# EAGLE design biochem_M (EAGLE 9.6.2)
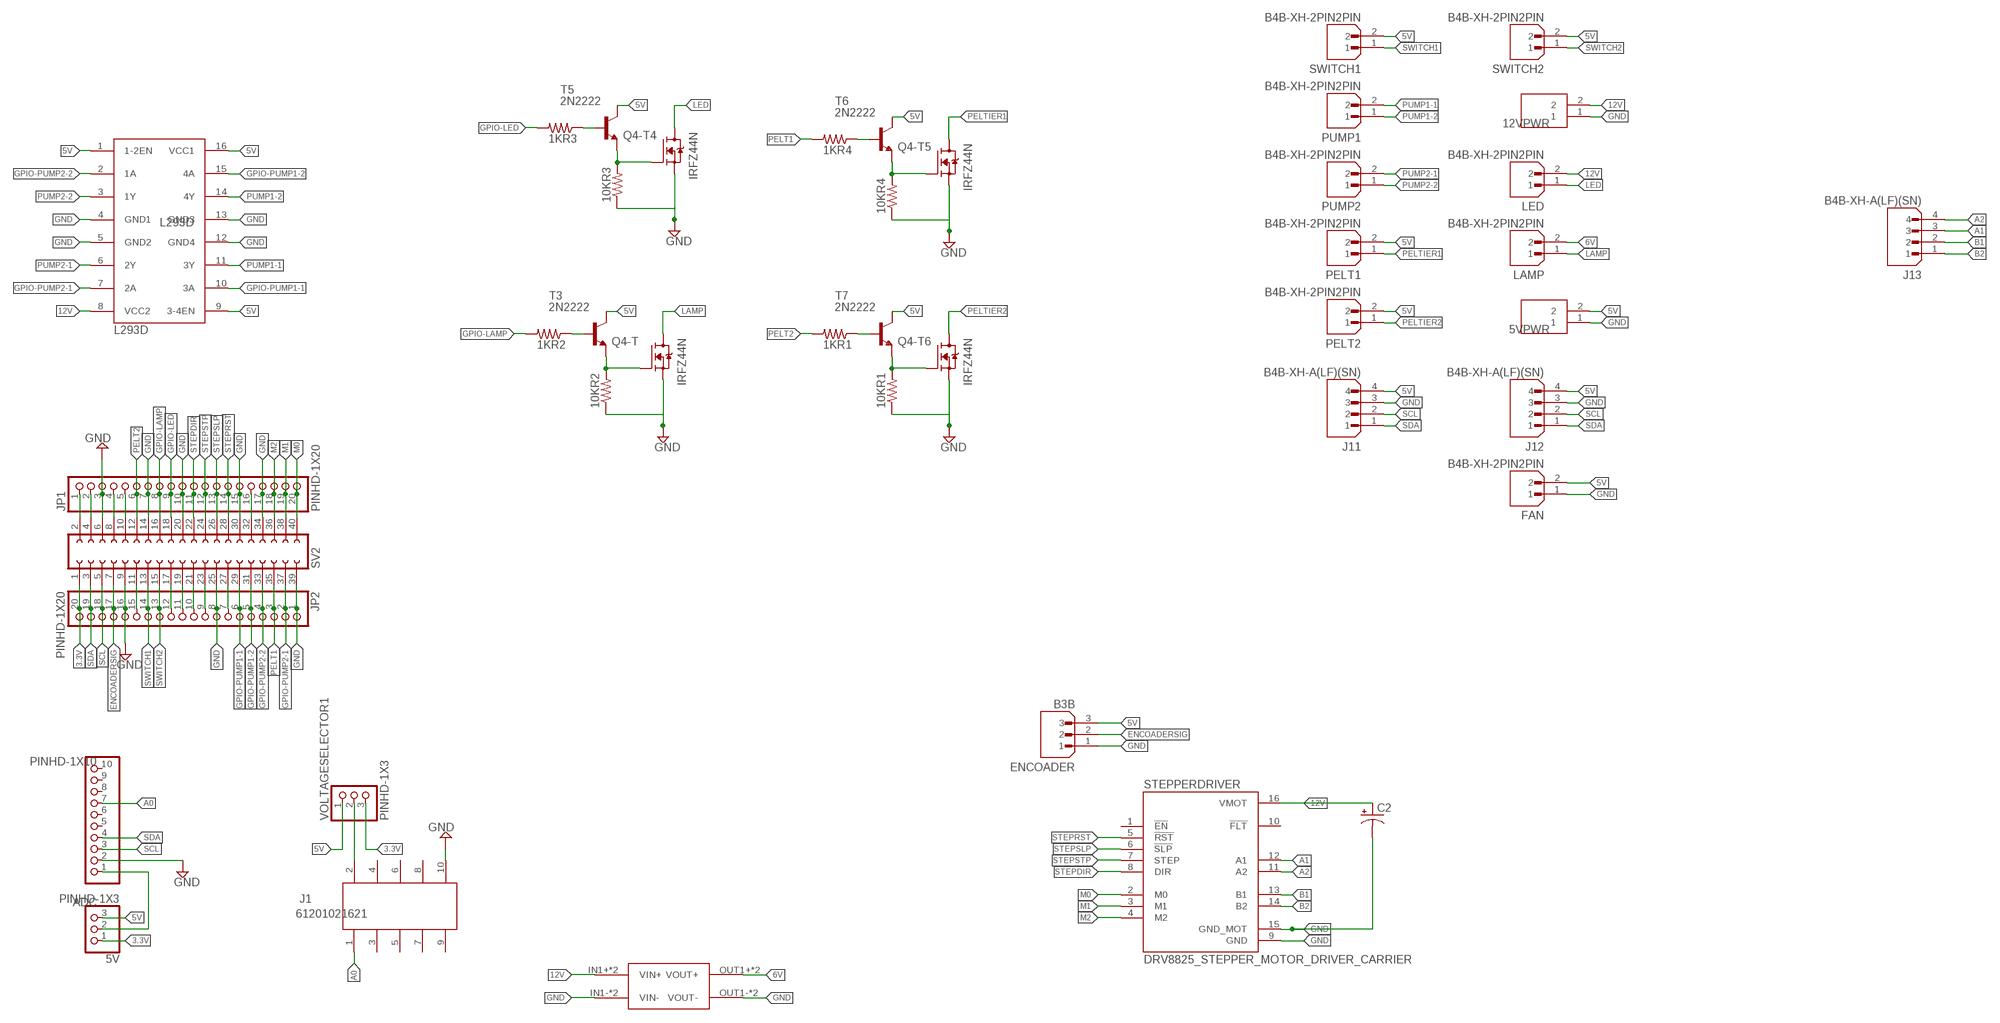
[diagram p0: schematic, sheet 1]

## Parts
1KR1  R-US_0204/7  [0204/7]
1KR2  R-US_0204/7  [0204/7]
1KR3  R-US_0204/7  [0204/7]
1KR4  R-US_0204/7  [0204/7]
5V  PINHD-1X3  [1X03]
5VPWR  TB010-508-02BE  [CUI_TB010-508-02BE]
10KR1  R-US_0204/7  [0204/7]
10KR2  R-US_0204/7  [0204/7]
10KR3  R-US_0204/7  [0204/7]
10KR4  R-US_0204/7  [0204/7]
12VPWR  TB010-508-02BE  [CUI_TB010-508-02BE]
ADC  PINHD-1X10  [1X10]
C2  CPOL-USB45181A  [B45181A]
ENCOADER  B3B  [B3B]
FAN  B4B-XH-2PIN2PIN  [B4BXH2]
J1  61201021621  [61201021621]
J11  B4B-XH-A(LF)(SN)  [JST_B4B-XH-A(LF)(SN)]
J12  B4B-XH-A(LF)(SN)  [JST_B4B-XH-A(LF)(SN)]
J13  B4B-XH-A(LF)(SN)  [JST_B4B-XH-A(LF)(SN)]
JP1  PINHD-1X20  [1X20]
JP2  PINHD-1X20  [1X20]
L293D  L293D  [DIL16]
LAMP  B4B-XH-2PIN2PIN  [B4BXH2]
LED  B4B-XH-2PIN2PIN  [B4BXH2]
PELT1  B4B-XH-2PIN2PIN  [B4BXH2]
PELT2  B4B-XH-2PIN2PIN  [B4BXH2]
PUMP1  B4B-XH-2PIN2PIN  [B4BXH2]
PUMP2  B4B-XH-2PIN2PIN  [B4BXH2]
Q4-T  IRFZ44N  [TO254P1016X419X2286-3]
Q4-T4  IRFZ44N  [TO254P1016X419X2286-3]
Q4-T5  IRFZ44N  [TO254P1016X419X2286-3]
Q4-T6  IRFZ44N  [TO254P1016X419X2286-3]
STEPPERDRIVER  DRV8825_STEPPER_MOTOR_DRIVER_CARRIER  [IC_DRV8825_STEPPER_MOTOR_DRIVER_CARRIER]
SV2  FE20-2  [FE20-2]
SWITCH1  B4B-XH-2PIN2PIN  [B4BXH2]
SWITCH2  B4B-XH-2PIN2PIN  [B4BXH2]
T3  2N2222  [TO92-EBC-OVAL]
T5  2N2222  [TO92-EBC-OVAL]
T6  2N2222  [TO92-EBC-OVAL]
T7  2N2222  [TO92-EBC-OVAL]
U$1  MP1584  [DC-BRICK]
VOLTAGESELECTOR1  PINHD-1X3  [1X03]

## Nets
3.3V: 5V.1 JP2.20 SV2.1 VOLTAGESELECTOR1.3
5V: 5V.3 5VPWR.2 ENCOADER.3 FAN.2 J11.4 J12.4 L293D.1(1-2EN) L293D.9(3-4EN) L293D.16(VCC1) PELT1.2 PELT2.2 SWITCH1.2 SWITCH2.2 T3.C T5.C T6.C T7.C VOLTAGESELECTOR1.1
6V: LAMP.2 U$1.OUT1+(VOUT+) U$1.OUT2+(VOUT+)
12V: 12VPWR.2 C2.+ L293D.8(VCC2) LED.2 STEPPERDRIVER.16(VMOT) U$1.IN1+(VIN+) U$1.IN2+(VIN+)
A0: ADC.7 J1.1
A1: J13.3 STEPPERDRIVER.12(A1)
A2: J13.4 STEPPERDRIVER.11(A2)
B1: J13.2 STEPPERDRIVER.13(B1)
B2: J13.1 STEPPERDRIVER.14(B2)
ENCOADERSIG: ENCOADER.2 JP2.17 SV2.7
GND: 5VPWR.1 10KR1.1 10KR2.1 10KR3.1 10KR4.1 12VPWR.1 ADC.2 C2.- ENCOADER.1 FAN.1 J1.10 J11.3 J12.3 JP1.3 JP1.7 JP1.10 JP1.15 JP1.17 JP2.1 JP2.8 JP2.16 L293D.4(GND1) L293D.5(GND2) L293D.12(GND4) L293D.13(GND3) Q4-T4.3(S) Q4-T5.3(S) Q4-T6.3(S) Q4-T.3(S) STEPPERDRIVER.9(GND) STEPPERDRIVER.15(GND_MOT) SV2.6 SV2.9 SV2.14 SV2.20 SV2.25 SV2.30 SV2.34 SV2.39 U$1.IN1-(VIN-) U$1.IN2-(VIN-) U$1.OUT1-(VOUT-) U$1.OUT2-(VOUT-)
GPIO-LAMP: 1KR2.2 JP1.8 SV2.16
GPIO-LED: 1KR3.2 JP1.9 SV2.18
GPIO-PUMP1-1: JP2.6 L293D.10(3A) SV2.29
GPIO-PUMP1-2: JP2.5 L293D.15(4A) SV2.31
GPIO-PUMP2-1: JP2.2 L293D.7(2A) SV2.37
GPIO-PUMP2-2: JP2.4 L293D.2(1A) SV2.33
LAMP: LAMP.1 Q4-T.2(D)
LED: LED.1 Q4-T4.2(D)
M0: JP1.20 STEPPERDRIVER.2(M0) SV2.40
M1: JP1.19 STEPPERDRIVER.3(M1) SV2.38
M2: JP1.18 STEPPERDRIVER.4(M2) SV2.36
N$1: JP1.1 SV2.2
N$2: JP1.2 SV2.4
N$3: JP1.4 SV2.8
N$4: 10KR2.2 Q4-T.1(G) T3.E
N$5: 1KR2.1 T3.B
N$6: JP1.5 SV2.10
N$7: JP2.15 SV2.11
N$8: J1.2 VOLTAGESELECTOR1.2
N$10: 5V.2 ADC.1
N$11: 10KR3.2 Q4-T4.1(G) T5.E
N$12: 1KR3.1 T5.B
N$14: 10KR4.2 Q4-T5.1(G) T6.E
N$15: 1KR4.1 T6.B
N$16: 10KR1.2 Q4-T6.1(G) T7.E
N$17: 1KR1.1 T7.B
N$20: JP1.16 SV2.32
N$26: JP2.7 SV2.27
N$28: JP2.9 SV2.23
N$29: JP2.10 SV2.21
N$30: JP2.11 SV2.19
N$31: JP2.12 SV2.17
PELT1: 1KR4.2 JP2.3 SV2.35
PELT2: 1KR1.2 JP1.6 SV2.12
PELTIER1: PELT1.1 Q4-T5.2(D)
PELTIER2: PELT2.1 Q4-T6.2(D)
PUMP1-1: L293D.11(3Y) PUMP1.2
PUMP1-2: L293D.14(4Y) PUMP1.1
PUMP2-1: L293D.6(2Y) PUMP2.2
PUMP2-2: L293D.3(1Y) PUMP2.1
SCL: ADC.3 J11.2 J12.2 JP2.18 SV2.5
SDA: ADC.4 J11.1 J12.1 JP2.19 SV2.3
STEPDIR: JP1.11 STEPPERDRIVER.8(DIR) SV2.22
STEPRST: JP1.14 STEPPERDRIVER.5(!RST) SV2.28
STEPSLP: JP1.13 STEPPERDRIVER.6(!SLP) SV2.26
STEPSTP: JP1.12 STEPPERDRIVER.7(STEP) SV2.24
SWITCH1: JP2.14 SV2.13 SWITCH1.1
SWITCH2: JP2.13 SV2.15 SWITCH2.1
Unconnected: ADC.5 ADC.6 ADC.8 ADC.9 ADC.10 J1.3 J1.4 J1.5 J1.6 J1.7 J1.8 J1.9 STEPPERDRIVER.1(!EN) STEPPERDRIVER.10(!FLT)

## Library data of the parts
1KR1-1KR4 10KR1-10KR4 = rcl:R-US_: RESISTOR, American symbol; SPICEPREFIX: R
5V VOLTAGESELECTOR1 = Connector:PINHD-1X3: PIN HEADER; CATEGORY: CONNECTOR; SUB-CATEGORY: PIN-HEADER
5VPWR 12VPWR = TB010-508-02BE:TB010-508-02BE: Check prices <https://pricing.snapeda.com/parts/TB010-508-02BE/CUI%20Devices/view-part?ref=eda>; AVAILABILITY: Good; CUI_PURCHASE_URL: https://www.cuidevices.com/product/interconnect/connectors/terminal-blocks/tb010-508-series?utm_source=snapeda.com&utm_medium=referral&utm_campaign=snapedaBOM; DESCRIPTION: 2~24 Poles, Screw Type, Horizontal, 5.08 Pitch, 26~12 (AWG), Terminal Block Connector; MF: CUI Devices; MP: TB010-508-02BE; PACKAGE: None; PRICE: None; PURCHASE-URL: https://pricing.snapeda.com/search/part/TB010-508-02BE/?ref=eda
ADC = Connector:PINHD-1X10: PIN HEADER; CATEGORY: CONNECTOR; SUB-CATEGORY: PIN-HEADER
C2 = adafruit:CPOL-US: POLARIZED CAPACITOR, American symbol
ENCOADER = B4B-XH-A_LF__SN_:B3B
FAN LAMP LED PELT1 PELT2 PUMP1 PUMP2 SWITCH1 SWITCH2 = B4B-XH-A_LF__SN_:B4B-XH-2PIN: Check availability <https://pricing.snapeda.com/parts/B4B-XH-A%20%20%28LF%29%28SN%29/JST/view-part?ref=eda>
J1 = 61201021621:61201021621: WR-BHD 2.54mm Male Box Header, 10 Pins=>Code : Con_WTB_BHD_2.54_Male_THT_WS_61201021621 <http://katalog.we-online.de/media/thumbs2/eican/thb_Con_WTB_BHD_2.54_Male_THT_WS_6120xx21621_pf2.jpg> Details see: http://katalog.we-online.de/en/em/612_0xx_216_21 Created 2014-06-04, Karrer Zheng 2014 (C) Würth Elektronik Check availability <https://pricing.snapeda.com/parts/61201021621/Wurth%20Elektronik/view-part?ref=eda>; AVAILABILITY: In Stock; DESCRIPTION: Connector Header Through Hole 10 position 0.100 (2.54mm); MF: Wurth Elektronik; MP: 61201021621; PACKAGE: None; PRICE: None; PURCHASE-URL: https://pricing.snapeda.com/search/part/61201021621/?ref=eda
J11-J13 = B4B-XH-A_LF__SN_:B4B-XH-A(LF)(SN): Check availability <https://pricing.snapeda.com/parts/B4B-XH-A%20%20%28LF%29%28SN%29/JST/view-part?ref=eda>; AVAILABILITY: In Stock; DESCRIPTION: HEADER, VERTICAL, 4WAY; Pitch Spacing: 2.5mm; No. of Contacts: 4Contacts; Gender: Header; Product Range: XH Series; Contact Termination Type: Through Hole; No. of Rows: 1Rows; Contact Plating: Tin Plated Contacts; Contact Material: Brass; SVHC: No SVHC (17-Dec-2015); Contact Resistance: 10mohm; Current Rating: 3A; Insulation Resistance: 1000Mohm; Operating Temperature Max: 85°C; Operating Temperature Min: -25°C; Voltage Rating VAC: 250V; Wire Size AWG Max: 22AWG; Wire Size AWG Min: 30AWG; Withstand Voltage: 1000V; MF: JST; MP: B4B-XH-A (LF)(SN); PACKAGE: None; PRICE: None; PURCHASE-URL: https://pricing.snapeda.com/search/part/B4B-XH-A (LF)(SN)/?ref=eda
JP1 JP2 = Connector:PINHD-1X20: PIN HEADER; CATEGORY: CONNECTOR; SUB-CATEGORY: PIN-HEADER
L293D = st-microelectronics:L293D: PUSH-PULL 4 CHANNEL DRIVER; MPN: L293D; OC_FARNELL: 9589619; OC_NEWARK: 56P8249
Q4-T Q4-T4-Q4-T6 = IRFZ44N:IRFZ44N: Check availability <https://pricing.snapeda.com/parts/IRFZ44N/Infineon%20Technologies/view-part?ref=eda>; AVAILABILITY: In Stock; DESCRIPTION: N-Channel 55 V 49A (Tc) 94W (Tc) Through Hole TO-220AB; MF: Infineon Technologies; MP: IRFZ44N; PACKAGE: TO-220-3 Infineon; PRICE: None; PURCHASE-URL: https://pricing.snapeda.com/search/part/IRFZ44N/?ref=eda
STEPPERDRIVER = DRV8825_STEPPER_MOTOR_DRIVER_CARRIER:DRV8825_STEPPER_MOTOR_DRIVER_CARRIER: Stepper motor controler; IC: DRV8825; 1.5A; Uin mot: 8.2÷45V Check availability <https://pricing.snapeda.com/parts/DRV8825%20STEPPER%20MOTOR%20DRIVER%20CARRIER/Pololu/view-part?ref=eda>; AVAILABILITY: Not in stock; DESCRIPTION: Stepper, Bipolar 8.2 ~ 45VDC Supply 1.5A 8.2 ~ 45V Load; MF: Pololu; MP: DRV8825 STEPPER MOTOR DRIVER CARRIER; PACKAGE: None; PRICE: None
SV2 = con-lsta:FE20-2: FEMALE HEADER; OC_FARNELL: unknown; OC_NEWARK: unknown
T3 T5-T7 = adafruit:2N2222: NPN TRANSISTOR Big oval pads
U$1 = mp1584:MP1584: MP1584-dc-brick-pcb Step down Input: 4.5V - 28V Ouput 0.8V - 25V max. 3A Cheap on ebay

## Board
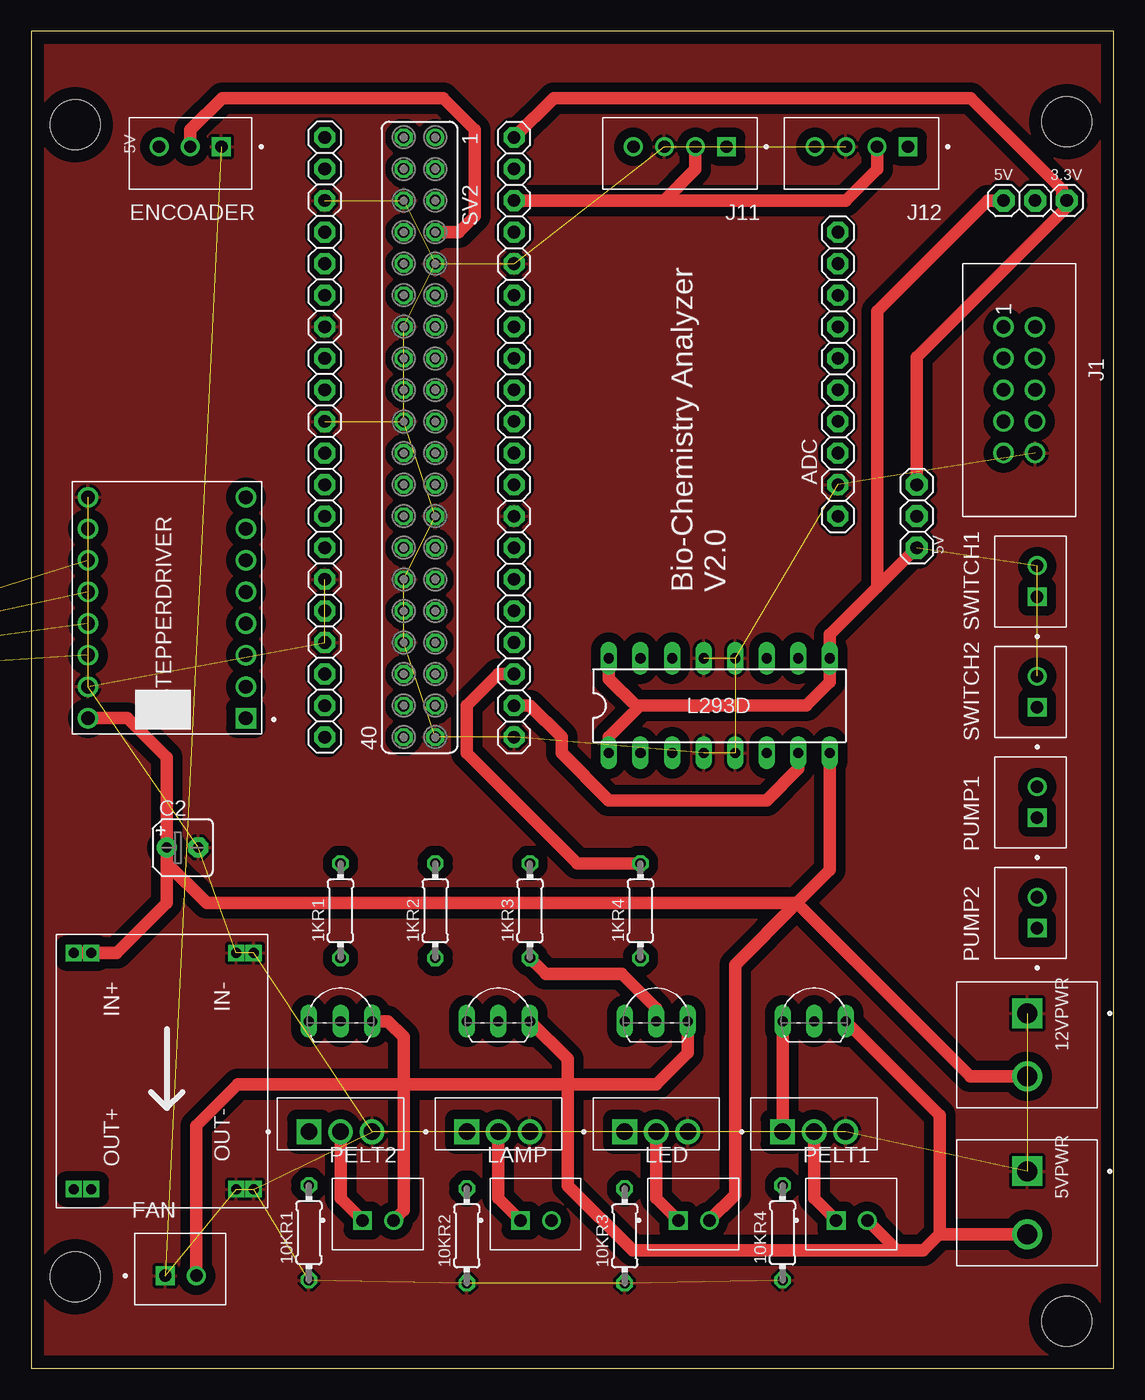
[diagram p1: board, top side]
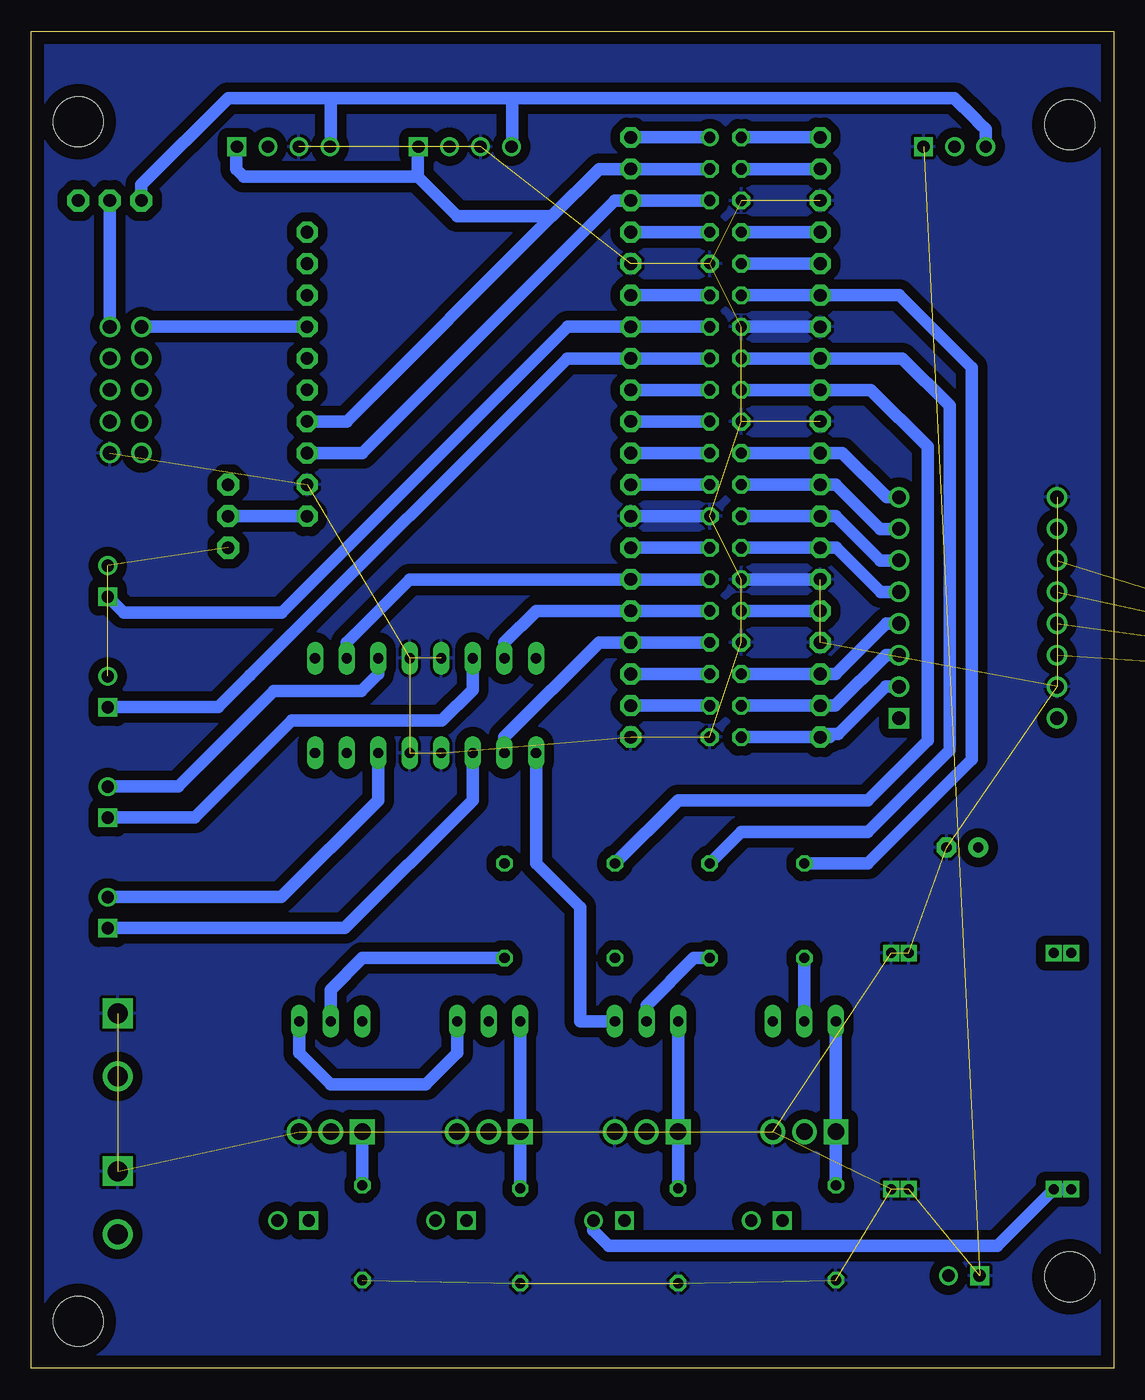
[diagram p2: board, bottom side, seen from below]

Size 87.1 x 107.62 mm. Coordinates in mm from the lower left corner, seen from the top.
Outline: 0,0 87.1,0 87.1,107.62 0,107.62 0,0
Copper layers (1*16): Top 0.035mm / dielectric 1.5mm / Bottom 0.035mm
Design rules "default *": minimum track width 40mil, minimum drill 0.35mm, track to track 30mil, track to pad 30mil, pad to pad 6mil, via to via 6mil, smd to smd 6mil, copper to edge 40mil, drill to drill 6mil, minimum pad ring 10mil, minimum via ring 8mil, stop-mask expansion 4mil, vias tented up to drill 0mil, thermal gap 10mil
Holes 4 mm at 3.56,100.08 3.56,7.37 83.31,3.81 83.31,100.33

### Footprints (pad centres in the part's own frame; a part is rotated, then mirrored left to right if it is on the bottom)
0204/7 = drill 0.813 octagon: 1 -3.81,0; 2 3.81,0
1X03 = drill 1.016 pad 1.778 octagon: 1 -2.54,0; 2 0,0; 3 2.54,0
CUI_TB010-508-02BE = drill 1.6 square: 1 0,0 | drill 1.6: 2 5.08,0
1X10 = drill 1.016 pad 1.676 octagon: 1 -11.43,0; 2 -8.89,0; 3 -6.35,0; 4 -3.81,0; 5 -1.27,0; 6 1.27,0; 7 3.81,0; 8 6.35,0; 9 8.89,0; 10 11.43,0
B45181A = drill 0.813 pad 1.6: + -1.27,0 | drill 0.813 pad 1.6 octagon: - 1.27,0
B3B = drill 1 square: 1 -2.48,-1.795 | drill 1: 2 0.02,-1.795; 3 2.52,-1.795
B4BXH2 = drill 1 square: 1 -1.4,0.475 | drill 1: 2 1.1,0.475
61201021621 = drill 1.1: 1 -5.08,-1.27; 2 -5.08,1.27; 3 -2.54,-1.27; 4 -2.54,1.27; 5 0,-1.27; 6 0,1.27; 7 2.54,-1.27; 8 2.54,1.27; 9 5.08,-1.27; 10 5.08,1.27
JST_B4B-XH-A(LF)(SN) = drill 1 square: 1 -3.75,-0.525 | drill 1: 2 -1.25,-0.525; 3 1.25,-0.525; 4 3.75,-0.525
1X20 = drill 1.016 pad 1.676 octagon: 1 -24.13,0; 2 -21.59,0; 3 -19.05,0; 4 -16.51,0; 5 -13.97,0; 6 -11.43,0; 7 -8.89,0; 8 -6.35,0; 9 -3.81,0; 10 -1.27,0; 11 1.27,0; 12 3.81,0; 13 6.35,0; 14 8.89,0; 15 11.43,0; 16 13.97,0; 17 16.51,0; 18 19.05,0; 19 21.59,0; 20 24.13,0
DIL16 = drill 0.813 long: 1 -8.89,-3.81; 2 -6.35,-3.81; 3 -3.81,-3.81; 4 -1.27,-3.81; 5 1.27,-3.81; 6 3.81,-3.81; 7 6.35,-3.81; 8 8.89,-3.81; 9 8.89,3.81; 10 6.35,3.81; 11 3.81,3.81; 12 1.27,3.81; 13 -1.27,3.81; 14 -3.81,3.81; 15 -6.35,3.81; 16 -8.89,3.81
TO254P1016X419X2286-3 = drill 1.33 square: 1 -2.54,0 | drill 1.33: 2 0,0; 3 2.54,0
IC_DRV8825_STEPPER_MOTOR_DRIVER_CARRIER = drill 1.1 square: 1 -6.35,8.89 | drill 1.1: 2 -6.35,6.35; 3 -6.35,3.81; 4 -6.35,1.27; 5 -6.35,-1.27; 6 -6.35,-3.81; 7 -6.35,-6.35; 8 -6.35,-8.89; 9 6.35,-8.89; 10 6.35,-6.35; 11 6.35,-3.81; 12 6.35,-1.27; 13 6.35,1.27; 14 6.35,3.81; 15 6.35,6.35; 16 6.35,8.89
FE20-2 = drill 0.914: 1 -24.13,1.27 | drill 0.914 octagon: 2 -24.13,-1.27; 3 -21.59,1.27; 4 -21.59,-1.27; 5 -19.05,1.27; 6 -19.05,-1.27; 7 -16.51,1.27; 8 -16.51,-1.27; 9 -13.97,1.27; 10 -13.97,-1.27; 11 -11.43,1.27; 12 -11.43,-1.27; 13 -8.89,1.27; 14 -8.89,-1.27; 15 -6.35,1.27; 16 -6.35,-1.27; 17 -3.81,1.27; 18 -3.81,-1.27; 19 -1.27,1.27; 20 -1.27,-1.27; 21 1.27,1.27; 22 1.27,-1.27; 23 3.81,1.27; 24 3.81,-1.27; 25 6.35,1.27; 26 6.35,-1.27; 27 8.89,1.27; 28 8.89,-1.27; 29 11.43,1.27; 30 11.43,-1.27; 31 13.97,1.27; 32 13.97,-1.27; 33 16.51,1.27; 34 16.51,-1.27; 35 19.05,1.27; 36 19.05,-1.27; 37 21.59,1.27; 38 21.59,-1.27; 39 24.13,1.27; 40 24.13,-1.27
TO92-EBC-OVAL = drill 0.813 long: B 0,-1.27; C 2.54,-1.27; E -2.54,-1.27
DC-BRICK = drill 0.8 square: IN1+ 1.5,1.4; IN1- 1.5,14.47; IN2+ 1.5,2.8; IN2- 1.5,15.87; OUT1+ 20.5,1.4; OUT1- 20.5,14.47; OUT2+ 20.5,2.8; OUT2- 20.5,15.87

### Placement (x,y rotation side)
1KR1  24.89,36.83 90 top
1KR2  32.51,36.83 90 top
1KR3  40.13,36.83 90 top
1KR4  49.02,36.83 90 top
5V  71.25,68.58 270 top
5VPWR  80.14,15.88 270 top
10KR1  22.35,10.92 90 top
10KR2  35.05,10.67 90 top
10KR3  47.75,10.67 90 top
10KR4  60.45,10.92 90 top
12VPWR  80.14,28.57 270 top
ADC  64.9,80.01 90 top
C2  12.19,41.91 0 top
ENCOADER  12.83,96.52 180 top
FAN  12.19,6.98 0 top
J1  79.5,78.74 270 top
J11  52.2,97.79 180 top
J12  66.8,97.79 180 top
J13  -32.26,55.25 0 top  (outside the outline)
JP1  23.62,74.93 270 top
JP2  38.86,74.93 90 top
L293D  55.37,53.34 0 top
LAMP  40.77,11.43 0 top
LED  53.47,11.43 0 top
PELT1  66.17,11.43 0 top
PELT2  28.07,11.43 0 top
PUMP1  81.41,45.72 90 top
PUMP2  81.41,36.83 90 top
Q4-T  37.59,19.05 0 top
Q4-T4  50.29,19.05 0 top
Q4-T5  62.99,19.05 0 top
Q4-T6  24.89,19.05 0 top
STEPPERDRIVER  10.92,61.21 180 top
SV2  31.24,74.93 270 top
SWITCH1  81.41,63.5 90 top
SWITCH2  81.41,54.61 90 top
T3  37.59,29.21 0 top
T5  50.29,29.21 0 top
T6  62.99,29.21 0 top
T7  24.89,29.21 0 top
U$1  2.03,34.92 270 top
VOLTAGESELECTOR1  80.77,93.98 0 top

### Tracks (layer width: path | path; a pad name or v marks a point on that pad's centre or on a via)
3.3V
  Top 1.016: 5V.1 71.25,81.4 83.31,93.47 VOLTAGESELECTOR1.3 82.93,94.36 82.93,94.87 75.57,102.23 42.04,102.23 JP2.20
  Bottom 1.016: SV2.1 JP2.20
5V  (2 unrouted)
  Top 1.016: 49.02,53.34 62.36,53.34 64.26,55.25 L293D.9 64.26,59.05 68.07,62.87 | 49.02,53.34 48.64,53.34 46.48,55.5 L293D.16 | L293D.1 46.48,50.8 49.02,53.34 | T7.C 28.7,27.94 29.97,26.67 29.97,22.86 | 29.97,22.86 29.97,12.71 PELT2.2 | T3.C 43.18,24.89 43.18,22.86 | 73.1,10.84 71.76,9.5 69.67,9.5 | 69.67,9.5 48.39,9.5 43.18,14.71 43.18,22.86 | T5.C 52.83,25.4 50.29,22.86 43.18,22.86 | 29.97,22.86 43.18,22.86 | 5VPWR.2 73.15,10.79 73.1,10.84 | 73.1,10.84 73.1,20.37 T6.C | PELT1.2 69.67,9.5 | FAN.2 13.29,19.52 16.64,22.86 29.97,22.86 | 68.07,62.87 5V.3 | VOLTAGESELECTOR1.1 76.96,93.98 68.07,85.09 68.07,62.87
  Bottom 1.016: L293D.1 46.48,40.64 42.93,37.08 42.93,27.94 T3.C | VOLTAGESELECTOR1.1 78.23,95.25 71.25,102.23 62.99,102.23 | 48.39,102.23 12.83,102.23 11.24,100.65 10.73,100.14 10.31,99.72 ENCOADER.3 | 48.39,102.23 62.99,102.23 | T6.C 65.53,25.4 62.99,22.86 55.37,22.86 52.83,25.4 T5.C | J11.4 48.39,98.38 48.39,102.23 | J12.4 62.99,98.38 62.99,102.23
6V
  Bottom 1.016: U$1.OUT1+ U$1.OUT2+ 9.38,9.88 40.65,9.88 41.87,11.1 LAMP.2
12V
  Top 1.016: 61.61,37.45 64.26,40.1 L293D.8 | 61.61,37.45 56.64,32.48 56.64,13.98 LED.2 | U$1.IN1+ U$1.IN2+ 6.88,33.42 10.92,37.47 C2.+ | 61.61,37.45 14.11,37.45 10.92,40.64 C2.+ | STEPPERDRIVER.16 7.75,52.32 10.92,49.15 C2.+ | 12VPWR.2 75.56,23.49 61.61,37.45
A0
  Bottom 1.016: J1.1 ADC.7
A1  (1 unrouted)
A2  (1 unrouted)
B1  (1 unrouted)
B2  (1 unrouted)
ENCOADERSIG
  Top 1.016: SV2.7 34.42,91.44 35.69,92.71 35.69,99.7 33.15,102.23 15.37,102.23 12.81,99.67 ENCOADER.2
  Bottom 1.016: JP2.17 SV2.7
GND  (39 unrouted)
  Bottom 1.016: JP2.8 SV2.25 | SV2.30 JP1.15 | SV2.14 JP1.7
  pour Bottom: 0.13,107.31 0.13,0 87.12,0 87.12,107.31
  pour Top: 0.13,107.31 0.13,0 87.12,0 87.12,107.31
GPIO-LAMP
  Bottom 1.016: SV2.16 JP1.8 17.02,81.28 13.21,77.47 13.21,49.78 19.81,43.18 29.97,43.18 1KR2.2
GPIO-LED
  Bottom 1.016: 1KR3.2 35.05,45.72 19.81,45.72 14.99,50.55 14.99,74.17 19.56,78.74 JP1.9 SV2.18
GPIO-PUMP1-1
  Bottom 1.016: SV2.29 JP2.6 56.64,63.5 61.72,58.42 L293D.10
GPIO-PUMP1-2
  Bottom 1.016: SV2.31 JP2.5 46.48,60.96 49.02,58.42 L293D.15
GPIO-PUMP2-1
  Top 1.016: JP2.2 40.13,53.34 42.67,50.8 42.67,49.53 46.48,45.72 59.18,45.72 61.72,48.26 L293D.7
  Bottom 1.016: SV2.37 JP2.2
GPIO-PUMP2-2
  Bottom 1.016: SV2.33 JP2.4 41.4,58.42 49.02,50.8 L293D.2
LAMP
  Top 1.016: Q4-T.2 37.59,13.68 LAMP.1
LED
  Top 1.016: Q4-T4.2 50.29,13.68 LED.1
M0
  Bottom 1.016: JP1.20 SV2.40 | 22.86,50.8 JP1.20 | STEPPERDRIVER.2 18.36,54.86 22.16,51.05 23.37,51.05 JP1.20
M1
  Bottom 1.016: SV2.38 JP1.19 22.39,53.34 18.33,57.4 STEPPERDRIVER.3
M2
  Bottom 1.016: SV2.36 JP1.18 22.37,55.88 18.3,59.94 STEPPERDRIVER.4
N$1
  Bottom 1.016: JP1.1 SV2.2
N$2
  Bottom 1.016: SV2.4 JP1.2
N$3
  Bottom 1.016: JP1.4 SV2.8
N$4
  Bottom 1.016: T3.E Q4-T.1 10KR2.2
N$5
  Bottom 1.016: T3.B 37.59,29.21 33.78,33.02 1KR2.1
N$6
  Bottom 1.016: SV2.10 JP1.5
N$7
  Bottom 1.016: SV2.11 JP2.15
N$8
  Bottom 1.016: VOLTAGESELECTOR1.2 J1.2
N$10
  Bottom 1.016: ADC.1 5V.2
N$11
  Bottom 1.016: 10KR3.2 Q4-T4.1 T5.E
N$12
  Top 1.016: 1KR3.1 41.4,31.75 47.5,31.75 50.29,28.96 T5.B
N$14
  Top 1.016: T6.E Q4-T5.1
  Bottom 1.016: Q4-T5.1 10KR4.2
N$15
  Bottom 1.016: T6.B 62.99,30.48 60.45,33.02 1KR4.1
N$16
  Bottom 1.016: T7.E Q4-T6.1 10KR1.2
N$17
  Bottom 1.016: T7.B 1KR1.1
N$20
  Bottom 1.016: JP1.16 SV2.32
N$26
  Bottom 1.016: SV2.27 JP2.7
N$28
  Bottom 1.016: SV2.23 JP2.9
N$29
  Bottom 1.016: JP2.10 SV2.21
N$30
  Bottom 1.016: SV2.19 JP2.11
N$31
  Bottom 1.016: JP2.12 SV2.17
PELT1
  Top 1.016: JP2.3 37.59,55.88 35.05,53.34 35.05,49.53 43.94,40.64 1KR4.2
  Bottom 1.016: SV2.35 JP2.3
PELT2
  Bottom 1.016: SV2.12 JP1.6 17.27,86.36 11.43,80.52 11.43,49.02 19.81,40.64 1KR1.2
PELTIER1
  Top 1.016: Q4-T5.2 62.99,13.68 PELT1.1
PELTIER2
  Top 1.016: Q4-T6.2 24.89,13.68 PELT2.1
PUMP1-1
  Bottom 1.016: L293D.11 59.18,55.88 60.53,54.53 67.56,54.53 75.28,46.82 PUMP1.2
PUMP1-2
  Bottom 1.016: L293D.14 51.56,54.61 54.05,52.12 66.12,52.12 73.92,44.32 PUMP1.1
PUMP2-1
  Bottom 1.016: PUMP2.2 66.97,37.93 59.18,45.72 L293D.6
PUMP2-2
  Bottom 1.016: L293D.3 51.56,45.72 61.85,35.43 PUMP2.1
SCL
  Top 1.016: J11.2 53.45,96.5 50.93,93.98 | JP2.18 50.93,93.98 | 50.93,93.98 65.53,93.98 68.07,96.52 68.07,98.3 J12.2
  Bottom 1.016: SV2.5 JP2.18 40.13,93.98 60.45,73.66 ADC.3
SDA
  Bottom 1.016: SV2.3 JP2.19 41.4,96.52 45.21,92.71 | ADC.4 61.72,76.2 45.21,92.71 | 45.21,92.71 52.83,92.71 56.01,95.89 | 56.01,95.89 56.01,98.25 J11.1 | 56.01,95.89 69.98,95.89 70.61,96.52 70.61,98.25 J12.1
STEPDIR
  Bottom 1.016: SV2.22 JP1.11 21.84,73.66 18.29,70.1 STEPPERDRIVER.8
STEPRST
  Bottom 1.016: SV2.28 JP1.14 22.33,66.04 18.77,62.48 STEPPERDRIVER.5
STEPSLP
  Bottom 1.016: SV2.26 JP1.13 22.35,68.58 18.8,65.02 STEPPERDRIVER.6
STEPSTP
  Bottom 1.016: SV2.24 JP1.12 22.35,71.12 18.8,67.56 STEPPERDRIVER.7
SWITCH1
  Bottom 1.016: SV2.13 JP2.14 43.94,83.82 66.93,60.83 79.66,60.83 SWITCH1.1
SWITCH2
  Bottom 1.016: SV2.15 JP2.13 43.97,81.28 69.5,55.75 72.04,53.21 SWITCH2.1

### Text on the board
tNames: 5V | 5V | 3.3V | 5V | Bio-Chemistry Analyzer / V2.0